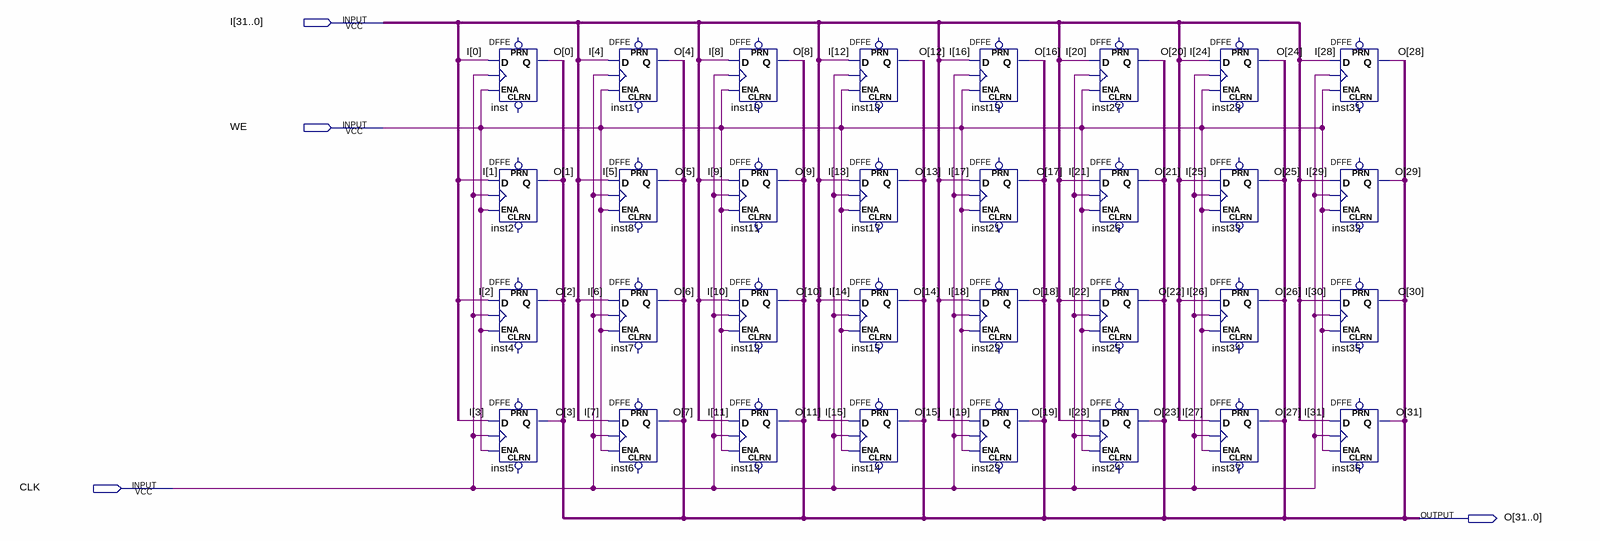
[diagram p0: schematic sheet]
// Quartus schematic register32e.bdf as structural Verilog: 32 symbols, 4 pins
module register32e (
  input  [31:0] I,
  input  WE,
  input  CLK,
  output [31:0] O
);

  DFFE inst (.D(I[0]), .CLK(CLK), .ENA(WE), .Q(O[0]));  // open: PRN, CLRN
  DFFE inst2 (.D(I[1]), .CLK(CLK), .ENA(WE), .Q(O[1]));  // open: PRN, CLRN
  DFFE inst4 (.D(I[2]), .CLK(CLK), .ENA(WE), .Q(O[2]));  // open: PRN, CLRN
  DFFE inst5 (.D(I[3]), .CLK(CLK), .ENA(WE), .Q(O[3]));  // open: PRN, CLRN
  DFFE inst1 (.D(I[4]), .CLK(CLK), .ENA(WE), .Q(O[4]));  // open: PRN, CLRN
  DFFE inst8 (.D(I[5]), .CLK(CLK), .ENA(WE), .Q(O[5]));  // open: PRN, CLRN
  DFFE inst7 (.D(I[6]), .CLK(CLK), .ENA(WE), .Q(O[6]));  // open: PRN, CLRN
  DFFE inst6 (.D(I[7]), .CLK(CLK), .ENA(WE), .Q(O[7]));  // open: PRN, CLRN
  DFFE inst10 (.D(I[8]), .CLK(CLK), .ENA(WE), .Q(O[8]));  // open: PRN, CLRN
  DFFE inst11 (.D(I[9]), .CLK(CLK), .ENA(WE), .Q(O[9]));  // open: PRN, CLRN
  DFFE inst12 (.D(I[10]), .CLK(CLK), .ENA(WE), .Q(O[10]));  // open: PRN, CLRN
  DFFE inst13 (.D(I[11]), .CLK(CLK), .ENA(WE), .Q(O[11]));  // open: PRN, CLRN
  DFFE inst18 (.D(I[12]), .CLK(CLK), .ENA(WE), .Q(O[12]));  // open: PRN, CLRN
  DFFE inst17 (.D(I[13]), .CLK(CLK), .ENA(WE), .Q(O[13]));  // open: PRN, CLRN
  DFFE inst15 (.D(I[14]), .CLK(CLK), .ENA(WE), .Q(O[14]));  // open: PRN, CLRN
  DFFE inst14 (.D(I[15]), .CLK(CLK), .ENA(WE), .Q(O[15]));  // open: PRN, CLRN
  DFFE inst19 (.D(I[16]), .CLK(CLK), .ENA(WE), .Q(O[16]));  // open: PRN, CLRN
  DFFE inst21 (.D(I[17]), .CLK(CLK), .ENA(WE), .Q(O[17]));  // open: PRN, CLRN
  DFFE inst22 (.D(I[18]), .CLK(CLK), .ENA(WE), .Q(O[18]));  // open: PRN, CLRN
  DFFE inst23 (.D(I[19]), .CLK(CLK), .ENA(WE), .Q(O[19]));  // open: PRN, CLRN
  DFFE inst27 (.D(I[20]), .CLK(CLK), .ENA(WE), .Q(O[20]));  // open: PRN, CLRN
  DFFE inst26 (.D(I[21]), .CLK(CLK), .ENA(WE), .Q(O[21]));  // open: PRN, CLRN
  DFFE inst25 (.D(I[22]), .CLK(CLK), .ENA(WE), .Q(O[22]));  // open: PRN, CLRN
  DFFE inst24 (.D(I[23]), .CLK(CLK), .ENA(WE), .Q(O[23]));  // open: PRN, CLRN
  DFFE inst28 (.D(I[24]), .CLK(CLK), .ENA(WE), .Q(O[24]));  // open: PRN, CLRN
  DFFE inst33 (.D(I[25]), .CLK(CLK), .ENA(WE), .Q(O[25]));  // open: PRN, CLRN
  DFFE inst34 (.D(I[26]), .CLK(CLK), .ENA(WE), .Q(O[26]));  // open: PRN, CLRN
  DFFE inst37 (.D(I[27]), .CLK(CLK), .ENA(WE), .Q(O[27]));  // open: PRN, CLRN
  DFFE inst31 (.D(I[28]), .CLK(CLK), .ENA(WE), .Q(O[28]));  // open: PRN, CLRN
  DFFE inst32 (.D(I[29]), .CLK(CLK), .ENA(WE), .Q(O[29]));  // open: PRN, CLRN
  DFFE inst35 (.D(I[30]), .CLK(CLK), .ENA(WE), .Q(O[30]));  // open: PRN, CLRN
  DFFE inst36 (.D(I[31]), .CLK(CLK), .ENA(WE), .Q(O[31]));  // open: PRN, CLRN
endmodule
